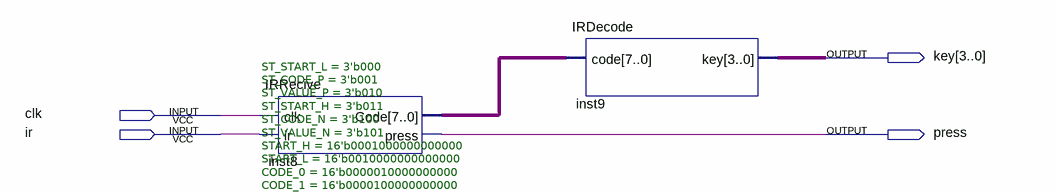
[diagram p0: schematic sheet]
// Quartus schematic IR.bdf as structural Verilog: 2 symbols, 4 pins
module IR (
  input  clk,
  input  ir,
  output [3:0] key,
  output press
);

  wire [7:0] inst8_code;

  IRRecive #(.ST_START_L(3'b000), .ST_CODE_P(3'b001), .ST_VALUE_P(3'b010), .ST_START_H(3'b011), .ST_CODE_N(3'b100), .ST_VALUE_N(3'b101), .START_H(16'b0001000000000000), .START_L(16'b0010000000000000), .CODE_0(16'b0000010000000000), .CODE_1(16'b0000100000000000)) inst8 (
    .clk(clk), .ir(ir), .Code(inst8_code), .press(press));
  IRDecode inst9 (.code(inst8_code), .key(key));
endmodule
